# EAGLE design NEECDUINO_V22 (EAGLE 6.1)
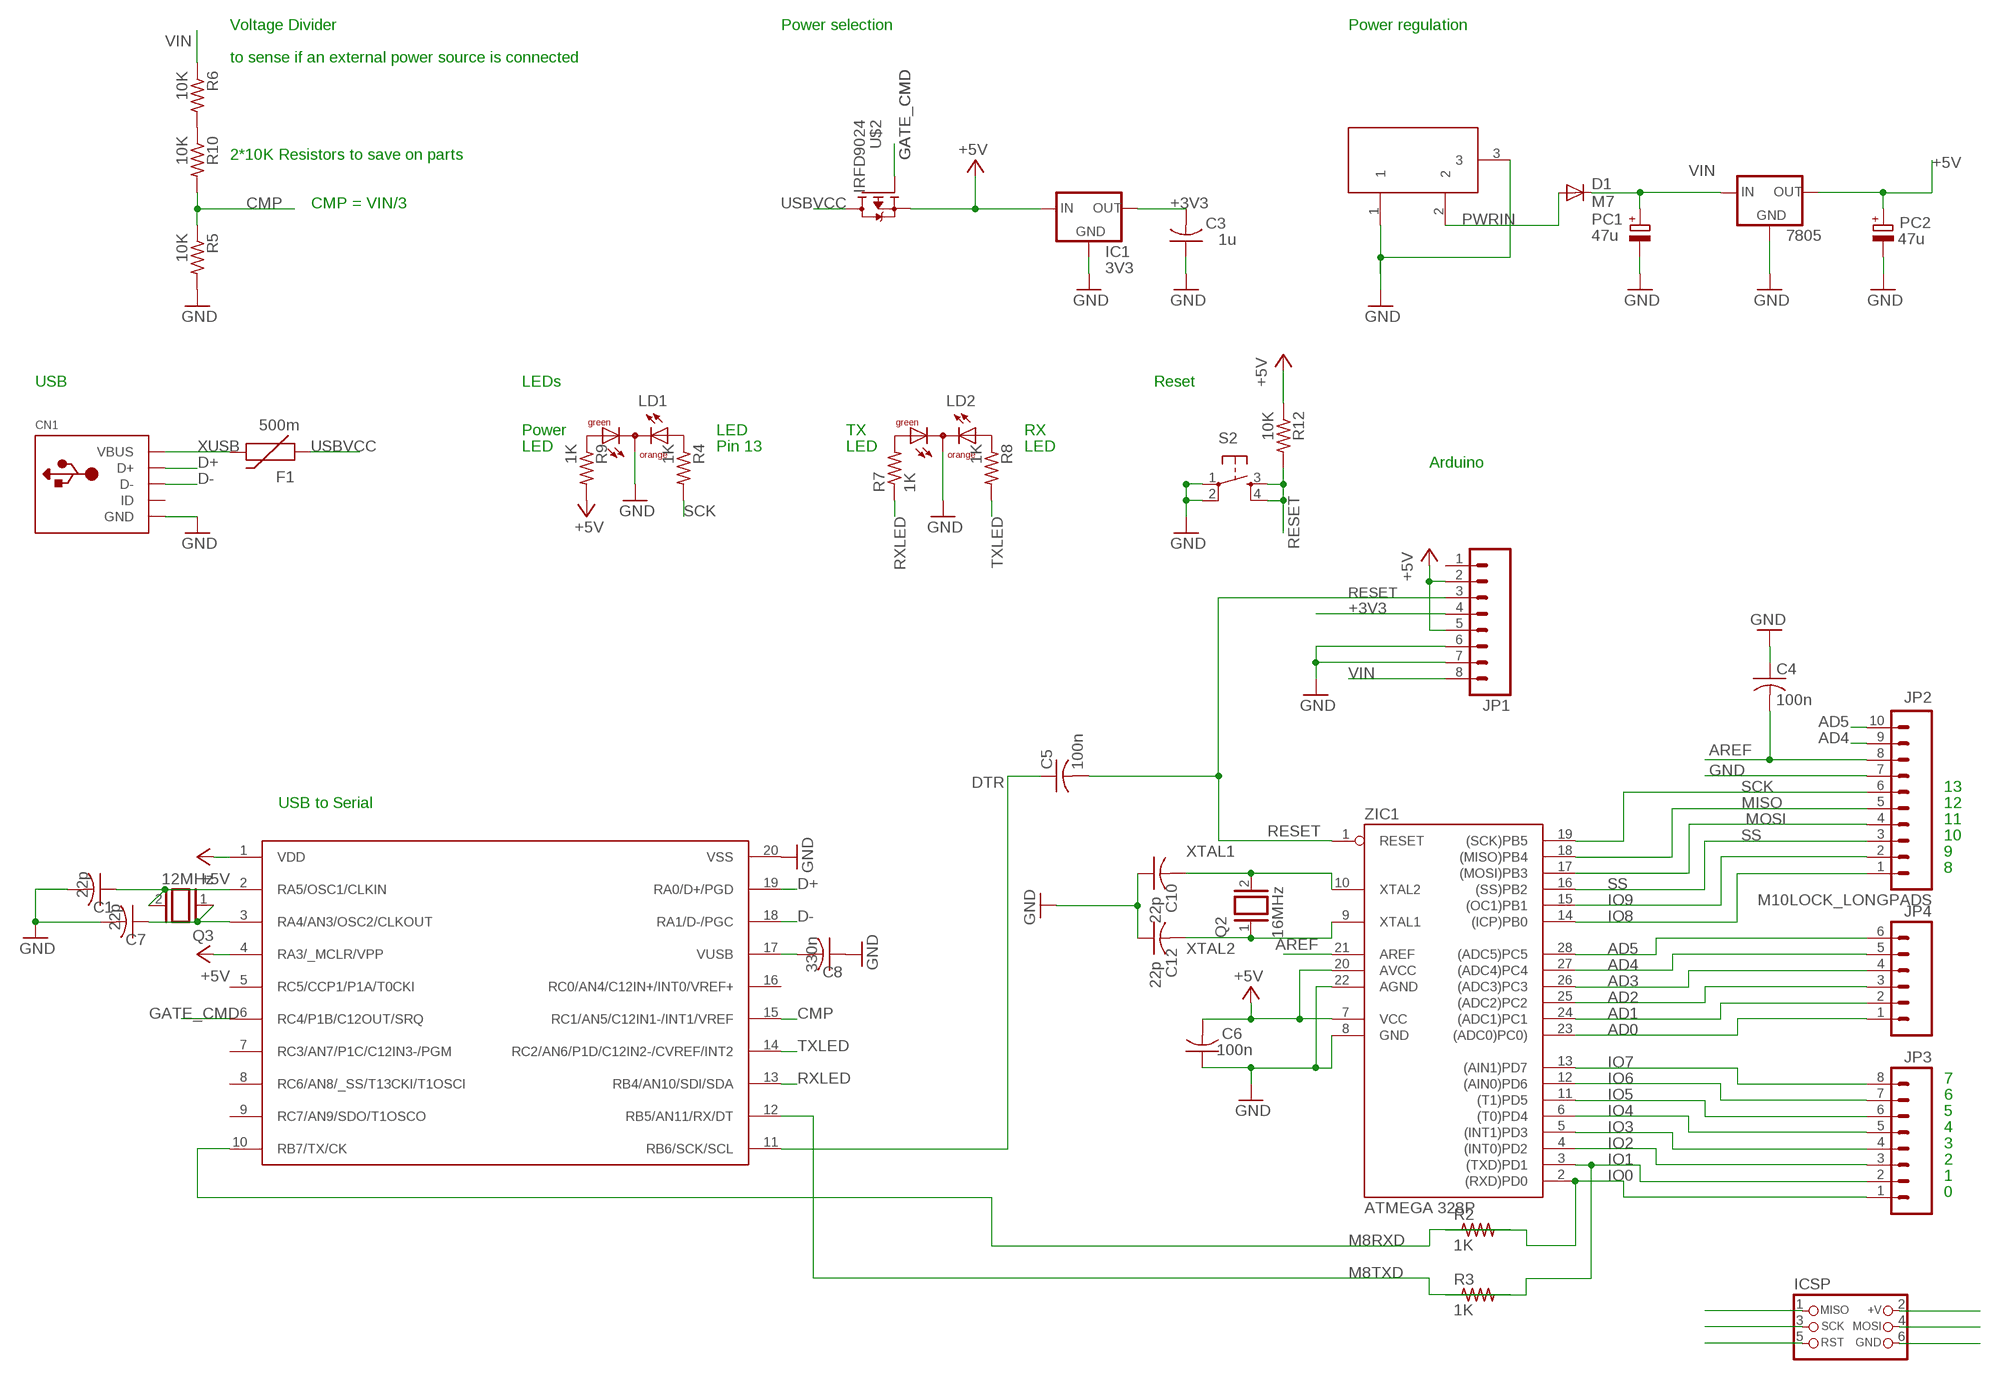
[diagram p0: schematic, sheet 1]

## Parts
7805  78XXL  [78XXL]
C1  22p  C-US025-025X050  [C025-025X050]
C3  1u  C-US050-024X044  [C050-024X044]
C4  100n  C-US025-025X050  [C025-025X050]
C5  100n  C-US025-025X050  [C025-025X050]
C6  100n  C-US025-025X050  [C025-025X050]
C7  22p  C-US025-025X050  [C025-025X050]
C8  330n  C-US025-025X050  [C025-025X050]
C10  22p  C-US025-025X050  [C025-025X050]
C12  22p  C-US025-025X050  [C025-025X050]
CN1  USBMOLEX  [USB-MINIB-THM-MOLEX]
D1  M7  DIODE-D-10  [D-10]
F1  500m  PTCPTH  [PTC]
IC1  3V3  LP2950  [TO92-INLINE]
ICSP  CON_HEADER_PRG_AVR_ICSP  [HEADER_PRG_2X03]
JP1  M08LOCK_LONGPADS  [1X08_LOCK_LONGPADS]
JP2  M10LOCK_LONGPADS  [1X10_LOCK_LONGPADS]
JP3  M08LOCK_LONGPADS  [1X08_LOCK_LONGPADS]
JP4  M06LOCK_LONGPADS  [1X06_LOCK_LONGPADS]
LD1  DUOLED-GO-C  [DUOLED-C-3MM]
LD2  DUOLED-GO-C  [DUOLED-C-3MM]
PC1  47u  CPOL-EUE2.5-5  [E2,5-5]
PC2  47u  CPOL-EUE2.5-5  [E2,5-5]
Q2  16MHz  XTAL/S  [QS]
Q3  12MHz  XTAL/S  [QS]
R2  1K  R-US_0204/5  [0204/5]
R3  1K  R-US_0204/5  [0204/5]
R4  1K  R-US_0204/5  [0204/5]
R5  10K  R-US_0204/5  [0204/5]
R6  10K  R-US_0204/5  [0204/5]
R7  1K  R-US_0204/5  [0204/5]
R8  1K  R-US_0204/5  [0204/5]
R9  1K  R-US_0204/5  [0204/5]
R10  10K  R-US_0204/5  [0204/5]
R12  10K  R-US_0204/5  [0204/5]
S2  TAC_SWITCHPTH  [TACTILE-PTH]
U$1  PIC18F14K50  PIC18XF1XK50  [DIL20]
U$2  IRFD9024  [DIL04]
X1  DC21MMX  [DC-21MM]
ZIC1  ATMEGA 328P  AT90S4433P  [DIL28-3]

## Nets
+3V3 [Power]: C3.2 IC1.1(OUT) JP1.4
+5V [Power]: 7805.OUT C6.2 IC1.3(IN) ICSP.2(+V) JP1.2 JP1.5 PC2.+ R9.2 R12.1 U$1.1(VDD) U$1.4(RA3/_MCLR/VPP) U$2.4(S) ZIC1.7(VCC) ZIC1.20(AVCC)
AD0: JP4.1 ZIC1.23((ADC0)PC0))
AD1: JP4.2 ZIC1.24((ADC1)PC1)
AD2: JP4.3 ZIC1.25((ADC2)PC2)
AD3: JP4.4 ZIC1.26((ADC3)PC3)
AD4: JP2.9 JP4.5 ZIC1.27((ADC4)PC4)
AD5: JP2.10 JP4.6 ZIC1.28((ADC5)PC5)
AREF: C4.2 JP2.8 ZIC1.21(AREF)
CMP: R5.1 R10.2 U$1.15(RC1/AN5/C12IN1-/INT1/VREF)
D+: CN1.D+ U$1.19(RA0/D+/PGD)
D-: CN1.D- U$1.18(RA1/D-/PGC)
DTR: C5.1 U$1.11(RB6/SCK/SCL)
GATE_CMD: U$1.6(RC4/P1B/C12OUT/SRQ) U$2.3(G)
GND: 7805.GND C1.2 C3.1 C4.1 C6.1 C7.2 C8.1 C10.1 C12.1 CN1.GND IC1.2(GND) ICSP.6(GND) JP1.6 JP1.7 JP2.7 LD1.C LD2.C PC1.- PC2.- R5.2 S2.1 S2.2 U$1.20(VSS) X1.1 X1.3 ZIC1.8(GND) ZIC1.22(AGND)
IO0: JP3.1 R2.1 ZIC1.2((RXD)PD0)
IO1: JP3.2 R3.1 ZIC1.3((TXD)PD1)
IO2: JP3.3 ZIC1.4((INT0)PD2)
IO3: JP3.4 ZIC1.5((INT1)PD3)
IO4: JP3.5 ZIC1.6((T0)PD4)
IO5: JP3.6 ZIC1.11((T1)PD5)
IO6: JP3.7 ZIC1.12((AIN0)PD6)
IO7: JP3.8 ZIC1.13((AIN1)PD7)
IO8: JP2.1 ZIC1.14((ICP)PB0)
IO9: JP2.2 ZIC1.15((OC1)PB1)
M8RXD: R2.2 U$1.10(RB7/TX/CK)
M8TXD: R3.2 U$1.12(RB5/AN11/RX/DT)
MISO: ICSP.1(MISO) JP2.5 ZIC1.18((MISO)PB4)
MOSI: ICSP.4(MOSI) JP2.4 ZIC1.17((MOSI)PB3)
N$1: R6.2 R10.1
N$2: LD1.AX(AR) R9.1
N$3: LD1.AR(AY) R4.1
N$4: LD2.AX(AR) R7.2
N$5: LD2.AR(AY) R8.1
N$6: C7.1 Q3.1 U$1.3(RA4/AN3/OSC2/CLKOUT)
N$12: C1.1 Q3.2 U$1.2(RA5/OSC1/CLKIN)
N$15: C8.2 U$1.17(VUSB)
PWRIN [Power]: D1.A X1.2
RESET: C5.2 ICSP.5(RST) JP1.3 R12.2 S2.3 S2.4 ZIC1.1(RESET)
RXLED: R7.1 U$1.13(RB4/AN10/SDI/SDA)
SCK: ICSP.3(SCK) JP2.6 R4.2 ZIC1.19((SCK)PB5)
SS: JP2.3 ZIC1.16((SS)PB2)
TXLED: R8.2 U$1.14(RC2/AN6/P1D/C12IN2-/CVREF/INT2)
USBVCC: F1.P$1 U$2.1(D) U$2.2(D)
VIN [Power]: 7805.IN D1.C JP1.8 PC1.+ R6.1
XTAL1: C10.2 Q2.2 ZIC1.10(XTAL2)
XTAL2: C12.2 Q2.1 ZIC1.9(XTAL1)
XUSB: CN1.VBUS F1.P$2
Unconnected: CN1.ID JP1.1 U$1.5(RC5/CCP1/P1A/T0CKI) U$1.7(RC3/AN7/P1C/C12IN3-/PGM) U$1.8(RC6/AN8/_SS/T13CKI/T1OSCI) U$1.9(RC7/AN9/SDO/T1OSCO) U$1.16(RC0/AN4/C12IN+/INT0/VREF+)

## Notes on the sheet
- Voltage Divider | Power selection | Power regulation
- to sense if an external power source is connected
- 2*10K Resistors to save on parts
- CMP = VIN/3
- USB | LEDs | Reset
- Power | LED | TX | RX
- LED | Pin 13 | LED | LED
- Arduino
- 13
- USB to Serial | 12
- 11
- 10
- 9
- 8
- 7
- 6
- 5
- 4
- 3
- 2
- 1
- 0

## Library data of the parts
7805 = v-reg:78XXL: VOLTAGE REGULATOR
C1 C3-C8 C10 C12 = adafruit:C-US: CAPACITOR, American symbol
CN1 = adafruit:USB: USB Connectors USBMINIB - Surface Mount Female Mini-B USB Connector 4UConnector: 06564 By microbuilder.eu Thru-hole RA Female Mini-B USB Connector 4UConnector: 18732 By ladyada.net
D1 = diode:DIODE-: DIODE
F1 = SparkFun:PTC: Resettable Fuse PTC Resettable Fuse. Spark Fun Electronics SKU : COM-08357
IC1 = pedrodiogo:LP2950?*: Source: http://cache.national.com/ds/LP/LP2950.pdf
ICSP = dp_devices:CON_HEADER_PRG_AVR_ICSP: 2x3 AVR ICSP programming header
JP1 JP3 = SparkFun:M08: Header 8 Standard 8-pin 0.1" header. Use with straight break away headers (SKU : PRT-00116), right angle break away headers (PRT-00553), swiss pins (PRT-00743), machine pins (PRT-00117), and female headers (PRT-00115).
JP2 = SparkFun:M10: Header 10 Standard 10-pin 0.1" header. Use with straight break away headers (SKU : PRT-00116), right angle break away headers (PRT-00553), swiss pins (PRT-00743), machine pins (PRT-00117), and female headers (PRT-00115).
JP4 = SparkFun:M06: Header 6 Standard 6-pin 0.1" header. Use with straight break away headers (SKU : PRT-00116), right angle break away headers (PRT-00553), swiss pins (PRT-00743), machine pins (PRT-00117), and female headers (PRT-00115). Molex polarized connector foot print use with SKU : PRT-08094 with associated crimp pins and housings. NOTES ON THE VARIANTS LOCK and LOCK_LONGPADS... This footprint was designed to help hold the alignment of a through-hole component (i.e. 6-pin header) while soldering it into place. You may notice that each hole has been shifted either up or down by 0.005 of an inch from it's more standard position (which is a perfectly straight line). This slight alteration caused the pins (the squares in the middle) to touch the edges of the holes. Because they are alternating, it causes a "brace" to hold the component in place. 0.005 has proven to be the perfect amount of "off-center" position when using our standard breakaway headers. Although looks a little odd when you look at the bare footprint, once you have a header in there, the alteration is very hard to notice. Also, if you push a header all the way into place, it is covered up entirely on the bottom side. This idea of altering the position of holes to aid alignment will be further integrated into the Sparkfun Library for other footprints. It can help hold any component with 3 or more connection pins.
LD1 LD2 = pedrodiogo:DUOLED-GO-C: DUO LED 2 colors (green/orange), 3 mm, round, common Cathode
PC1 PC2 = rcl:CPOL-EU: POLARIZED CAPACITOR, European symbol
Q2 Q3 = special:XTAL/S: CRYSTAL
R2-R10 R12 = adafruit:R-US_: RESISTOR, American symbol
S2 = SparkFun:TAC_SWITCH: Momentary Switch Button commonly used for reset or general input. Spark Fun Electronics SKU : COM-00097
U$1 = PIC18F1xK50:PIC18XF1XK50: PIC18F13K50/14K50 PIC18LF13K50/14K50
U$2 = pedrodiogo:IRFD9024
X1 = powersupply:DC21MM
ZIC1 = atmel:AT90S4433: MICROCONTROLLER 4 Kbytes FLASH 128 bytes SRAM 256 bytes EEPROM UART 6-channel 10 bit ADC

## Net classes
0 default: width 0.305 mm, drill 0.305 mm, clearance 0.203 mm
1 Power: width 1.016 mm, drill 0.61 mm, clearance 0.305 mm

## Board
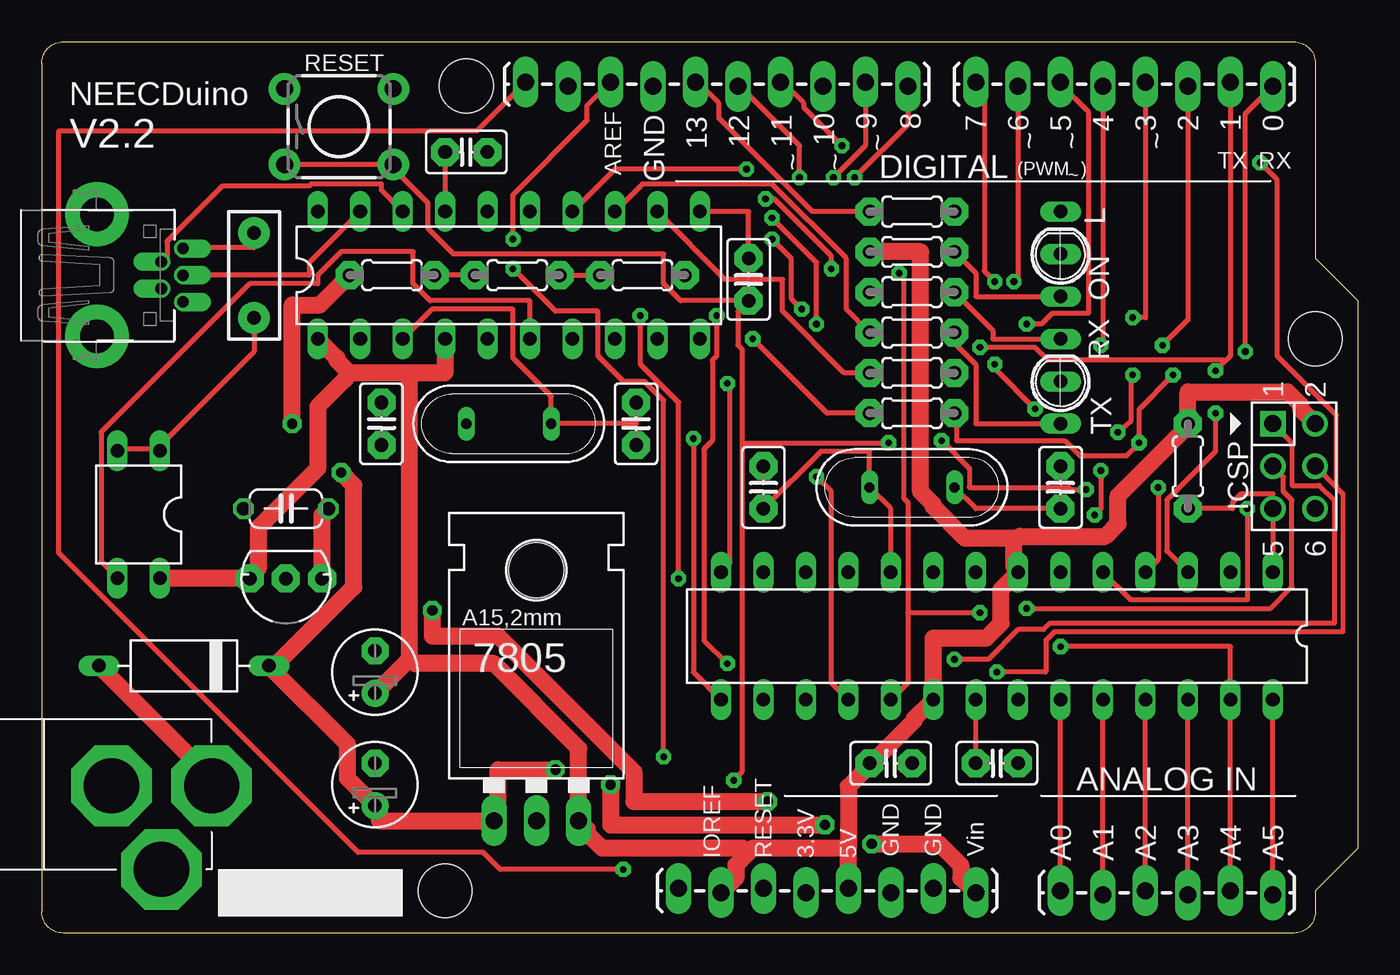
[diagram p1: board, top side]
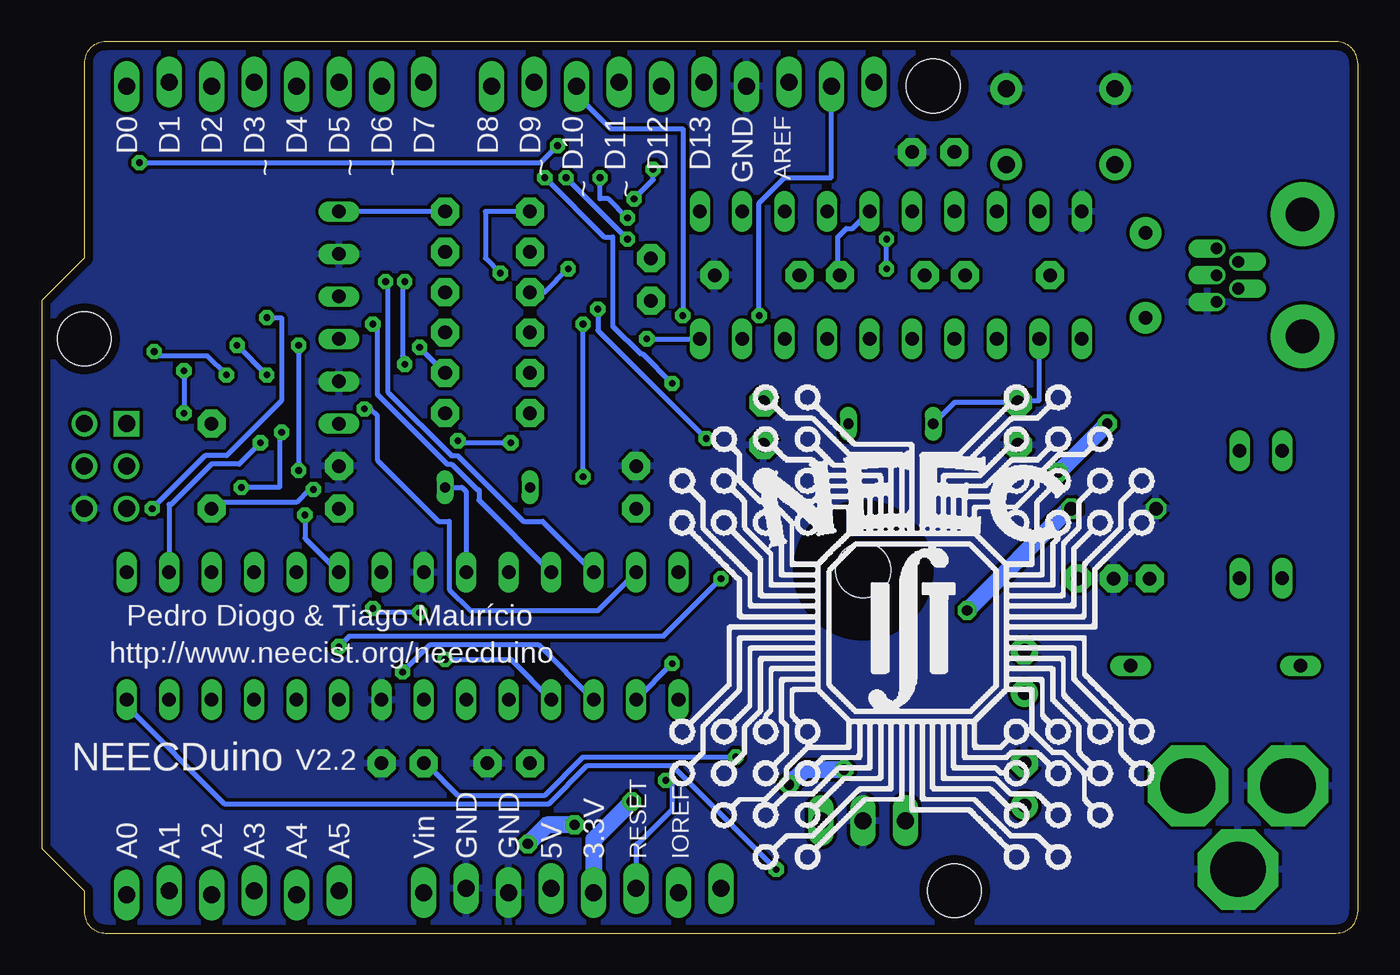
[diagram p2: board, bottom side, seen from below]

Size 78.74 x 53.34 mm. Coordinates in mm from the lower left corner, seen from the top.
Outline: 0,52.07 0,1.27 arc90 1.27,0 74.93,0 arc90 76.2,1.27 76.2,2.54 78.74,5.08 78.74,37.85 76.2,40.39 76.2,52.07 arc90 74.93,53.34 1.27,53.34 arc90 0,52.07
Copper layers (1*16): Top 0.035mm / dielectric 1.5mm / Bottom 0.035mm
Design rules: minimum track width 8mil, minimum drill 0.4mm, track to track 8mil, track to pad 8mil, pad to pad 8mil, via to via 8mil, smd to smd 8mil, copper to edge 20mil, drill to drill 8mil, minimum pad ring 8mil, minimum via ring 10mil, stop-mask expansion 3mil, vias tented up to drill 0mil, thermal gap 8mil
Holes 3.2 mm at 24.13,2.54 76.2,35.56 25.4,50.7
tKeepout: area 21.1,30.5 to 29.7,30.5
bKeepout: area 20.8,30.5 to 29.8,30.6; area 18.8,7.3 to 24.4,13
tRestrict: area 25.8,17.9 to 33.4,25.6

### Footprints (pad centres in the part's own frame; a part is rotated, then mirrored left to right if it is on the bottom)
78XXL = drill 1.016 long: GND 0,-3.81; IN -2.54,-3.81; OUT 2.54,-3.81 | hole 3.302: 0,11.176
C025-025X050 = drill 0.813 pad 1.676 octagon: 1 -1.27,0; 2 1.27,0
C050-024X044 = drill 0.813 octagon: 1 -2.54,0; 2 2.54,0
USB-MINIB-THM-MOLEX = drill 0.7 offset: D+ 0,9.72; D- -0.8,8.42; GND 1.6,9.72; ID 0.8,8.42; VBUS -1.6,9.72 | drill 2 pad 3.81: GND1 -3.65,4.57; GND4 3.65,4.57
D-10 = drill 0.813 long: A 5.08,0; C -5.08,0
PTC = drill 0.8 pad 1.88: P$1 -2.54,0; P$2 2.54,0
TO92-INLINE = drill 0.813 pad 1.676 octagon: 1 -2.159,0; 2 0,0; 3 2.159,0
HEADER_PRG_2X03 = drill 1.016 square: 1 -2.54,-1.27 | drill 1.016: 2 -2.54,1.27; 3 0,-1.27; 4 0,1.27; 5 2.54,-1.27; 6 2.54,1.27
1X08_LOCK_LONGPADS = drill 1.016 long: 1 0,0.127; 2 2.54,-0.127; 3 5.08,0.127; 4 7.62,-0.127; 5 10.16,0.127; 6 12.7,-0.127; 7 15.24,0.127; 8 17.78,-0.127
1X10_LOCK_LONGPADS = drill 1.016 long: 1 0,0.127; 2 2.54,-0.127; 3 5.08,0.127; 4 7.62,-0.127; 5 10.16,0.127; 6 12.7,-0.127; 7 15.24,0.127; 8 17.78,-0.127; 9 20.32,0.127; 10 22.86,-0.127
1X06_LOCK_LONGPADS = drill 1.016 long: 1 0,0; 2 2.54,-0.254; 3 5.08,0; 4 7.62,-0.254; 5 10.16,0; 6 12.7,-0.254
DUOLED-C-3MM = drill 0.813 long: AR 2.54,0; AX -2.54,0; C 0,0
E2,5-5 = drill 0.813 pad 1.6: + -1.27,0 | drill 0.813 pad 1.6 octagon: - 1.27,0
QS = drill 0.61 long: 1 -2.54,0; 2 2.54,0
0204/5 = drill 0.813 pad 1.676 octagon: 1 -2.54,0; 2 2.54,0
TACTILE-PTH = drill 1.016 pad 1.88: 1 -3.251,2.261; 2 3.251,2.261; 3 -3.251,-2.261; 4 3.251,-2.261
DIL20 = drill 0.813 long: 1 -11.43,-3.81; 2 -8.89,-3.81; 3 -6.35,-3.81; 4 -3.81,-3.81; 5 -1.27,-3.81; 6 1.27,-3.81; 7 3.81,-3.81; 8 6.35,-3.81; 9 8.89,-3.81; 10 11.43,-3.81; 11 11.43,3.81; 12 8.89,3.81; 13 6.35,3.81; 14 3.81,3.81; 15 1.27,3.81; 16 -1.27,3.81; 17 -3.81,3.81; 18 -6.35,3.81; 19 -8.89,3.81; 20 -11.43,3.81
DIL04 = drill 0.813 long: 1 -1.27,-3.81; 2 1.27,-3.81; 3 1.27,3.81; 4 -1.27,3.81
DC-21MM = drill 3.302 pad 4.826 octagon: 1 -5.08,-3.353; 2 -0.076,-6.35; 3 -0.076,-0.356
DIL28-3 = drill 0.813 long: 1 -16.51,-3.81; 2 -13.97,-3.81; 3 -11.43,-3.81; 4 -8.89,-3.81; 5 -6.35,-3.81; 6 -3.81,-3.81; 7 -1.27,-3.81; 8 1.27,-3.81; 9 3.81,-3.81; 10 6.35,-3.81; 11 8.89,-3.81; 12 11.43,-3.81; 13 13.97,-3.81; 14 16.51,-3.81; 15 16.51,3.81; 16 13.97,3.81; 17 11.43,3.81; 18 8.89,3.81; 19 6.35,3.81; 20 3.81,3.81; 21 1.27,3.81; 22 -1.27,3.81; 23 -3.81,3.81; 24 -6.35,3.81; 25 -8.89,3.81; 26 -11.43,3.81; 27 -13.97,3.81; 28 -16.51,3.81

### Placement (x,y rotation side)
7805  29.59,10.54 0 top
C1  20.32,30.48 270 top
C3  14.61,25.4 0 top
C4  57.15,10.16 180 top
C5  42.29,39.12 270 top
C6  50.8,10.16 180 top
C7  35.56,30.48 270 top
C8  25.4,46.74 180 top
C10  43.18,26.67 270 top
C12  60.96,26.67 270 top
CN1  -1.27,39.37 270 top
D1  8.51,16 180 top
F1  12.7,39.37 90 top
IC1  14.61,21.21 180 top
ICSP  74.93,27.94 270 top
JP1  38.1,2.54 0 top
JP2  51.82,50.8 180 top
JP3  73.66,50.8 180 top
JP4  60.96,2.54 0 top
LD1  60.96,40.64 90 top
LD2  60.96,33.02 90 top
PC1  19.94,8.89 90 top
PC2  19.94,15.62 90 top
Q2  52.07,26.67 180 top
Q3  27.94,30.48 180 top
R2  52.07,31.11 180 top
R3  52.07,33.53 180 top
R4  52.07,43.18 180 top
R5  35.94,39.37 0 top
R6  20.96,39.37 0 top
R7  52.07,35.94 0 top
R8  52.07,38.35 180 top
R9  52.07,40.77 180 top
R10  28.45,39.37 0 top
R12  68.58,27.94 270 top
S2  17.78,48.26 0 top
U$1  27.94,39.37 0 top
U$2  5.79,25.05 180 top
X1  3.81,8.89 90 top
ZIC1  57.15,17.78 180 top

### Tracks (layer width: path | path; a pad name or v marks a point on that pad's centre or on a via)
+3V3  (via drill 0.61)
  Top 1.016: C3.2 16.76,25.02 IC1.1 | v43.43,7.87 35.43,7.87 35.43,9.65 27.31,17.78 23.37,17.78 v23.37,19.3
  Bottom 1.016: JP1.4 45.72,5.59 v43.43,7.87 | v23.37,19.3 17.27,25.4 C3.2
+5V
  Top 1.016: U$2.4 7.11,21.21 IC1.3 12.7,21.59 12.95,21.84 12.95,24.26 16.51,27.81 16.51,31.5 18.16,33.15 18.42,33.53 | U$1.1 17.65,34.42 17.65,34.29 18.42,33.53 | 21.97,33.53 24.13,33.53 U$1.4 | 21.97,33.53 18.42,33.53 | 21.97,16.38 PC2.+ | 21.97,33.53 21.97,16.38 | JP1.2 41.53,3.3 41.53,4.06 42.23,4.76 | 42.23,4.76 42.55,5.08 48.26,5.08 | JP1.5 48.26,5.08 | 42.23,4.76 41.91,5.08 33.53,5.08 32.64,5.97 32.64,6.22 7805.OUT 32.13,11.05 27.05,16.13 22.35,16.13 21.97,16.38 | ICSP.2 75.31,31.37 75.31,31.62 74.55,32.38 68.58,32.38 R12.1 68.33,30.1 64.39,26.16 64.39,24.51 63.63,23.75 58.55,23.75 58.17,23.62 | R9.2 52.58,40.77 52.58,26.42 53.34,25.65 53.34,25.53 55.24,23.62 58.17,23.62 | 58.17,23.62 58.17,21.97 ZIC1.7 57.4,20.57 57.4,18.54 56.52,17.65 53.34,17.65 ZIC1.20 52.2,12.83 52.2,12.7 49.66,10.16 C6.2 49.28,9.78 48.26,8.76 48.26,5.08
AD0
  Top 0.305: JP4.1 ZIC1.23
AD1
  Top 0.305: JP4.2 ZIC1.24
AD2
  Top 0.305: JP4.3 ZIC1.25
AD3
  Top 0.305: JP4.4 ZIC1.26
AD4  (via drill 0.4)
  Top 0.305: JP4.5 ZIC1.27 71.12,17.14 v60.96,17.14 | v35.81,36.96 35.81,34.04 38.1,31.75 v38.1,21.21
  Bottom 0.305: v35.81,36.96 35.81,43.69 34.29,45.21 31.5,45.21 JP2.9 | v38.1,21.21 41.53,17.78 60.33,17.78 v60.96,17.14
AD5  (via drill 0.4)
  Top 0.305: JP4.6 ZIC1.28 | v34.8,3.81 27.43,3.81 26.42,4.83 18.92,4.83 1.02,22.73 1.02,48.01 26.04,48.01 JP2.10
  Bottom 0.305: v34.8,3.81 41.02,10.03 46.1,10.03 48.39,7.75 67.82,7.75 73.66,13.59 ZIC1.28
AREF  (via drill 0.4)
  Top 0.305: C4.2 ZIC1.21 | v28.19,41.53 28.19,44.2 32.64,48.64 32.64,49.53 JP2.8 | v28.19,39.75 30.73,37.21 33.27,37.21 33.27,34.54 34.8,33.02 36.07,33.02 37.21,31.88 v37.21,10.54
  Bottom 0.305: v28.19,39.75 v28.19,41.53 | v37.21,10.54 46.35,10.54 48.64,8.26 53.85,8.26 55.75,10.16 C4.2
CMP
  Top 0.305: R10.2 R5.1
  Bottom 0.305: U$1.15 30.23,42.16 30.61,42.16 31.11,41.66 31.11,39.37 R10.2
D+
  Top 0.305: CN1.D+ 16,39.37 16,40.13 U$1.19
D-
  Top 0.305: CN1.D- 7.49,40.51 7.49,41.4 10.79,44.7 16,44.7 16.13,44.83 20.32,44.83 20.32,44.45 U$1.18
DTR
  Top 0.305: U$1.11 42.29,43.18 C5.1
GATE_CMD
  Top 0.305: U$1.6 29.21,37.85 23.24,37.85 22.22,38.86 22.22,40.77 17.91,40.77 16.51,39.37 16.51,38.86 12.45,38.86 3.56,29.97 3.56,22.23 4.45,21.34 U$2.3
GND
  pour Bottom: 0,45.72 0,52.07 arc-90 1.27,53.34 74.93,53.34 arc-90 76.2,52.07 76.2,40.64 78.74,38.1 78.74,5.08 76.2,2.54 76.2,1.27 arc-90 74.93,0 1.27,0 arc-90 0,1.27
  pour Bottom: 0,45.72 0,52.07 arc-90 1.27,53.34 74.93,53.34 arc-90 76.2,52.07 76.2,40.64 78.74,38.1 78.74,5.08 76.2,2.54 76.2,1.27 arc-90 74.93,0 1.27,0 arc-90 0,1.27
IO0  (via drill 0.4)
  Top 0.305: R2.1 54.74,30.99 54.74,29.46 61.21,29.46 62.1,28.57 64.9,28.57 v65.66,29.34 65.66,31.37 v67.69,33.4 | JP3.1 72.01,49.02 v72.01,34.8
  Bottom 0.305: ZIC1.2 71.12,25.65 70.99,25.65 68.58,28.07 66.93,28.07 v65.66,29.34 | v72.01,34.8 71.75,34.54 68.83,34.54 v67.69,33.4
IO1  (via drill 0.4)
  Top 0.305: ZIC1.3 67.31,22.86 67.31,25.91 70.23,28.83 v70.23,31.11 | 70.8,34.23 71.12,34.54 JP3.2 | 70.8,34.23 v70.23,33.66 | v56.13,35.05 59.44,35.05 60.2,34.29 70.74,34.29 70.8,34.23
  Bottom 0.305: v70.23,33.66 v70.23,31.11 | v56.13,35.05 R3.1
IO2  (via drill 0.4)
  Top 0.305: ZIC1.4 66.8,22.35 v66.8,26.67 | v64.39,29.97 65.15,30.61 65.15,33.27 v65.28,33.4 | v67.06,35.18 68.58,36.7 JP3.3
  Bottom 0.305: v64.39,29.97 64.52,29.97 64.52,26.67 v66.8,26.67 | v67.06,35.18 v65.28,33.4
IO3  (via drill 0.4)
  Top 0.305: ZIC1.5 65.15,19.94 72.14,19.94 v72.14,25.4 | v65.28,36.83 66.04,36.83 JP3.4
  Bottom 0.305: v72.14,25.4 68.96,28.57 67.69,28.57 64.39,31.88 64.39,36.83 v65.28,36.83
IO4  (via drill 0.4)
  Top 0.305: v62.99,25.02 63.37,25.4 v63.37,27.69 | v63.37,35.18 63.5,35.56 JP3.5
  Bottom 0.305: ZIC1.6 62.99,23.62 v62.99,25.02 | v63.37,35.18 v63.37,27.69
IO5  (via drill 0.4)
  Top 0.305: v58.93,36.45 59.82,36.45 60.45,37.08 62.61,37.08 62.61,49.15 60.96,50.8 JP3.6
  Bottom 0.305: ZIC1.11 52.58,25.91 52.58,26.54 52.7,26.54 54.23,28.07 54.48,28.07 58.67,32.26 58.67,36.45 v58.93,36.45
IO6  (via drill 0.4)
  Top 0.305: v58.17,38.99 58.42,39.24 JP3.7
  Bottom 0.305: ZIC1.12 48.77,24.64 49.91,24.64 53.85,28.57 54.23,28.57 58.04,32.38 58.04,38.99 v58.17,38.99
IO7  (via drill 0.4)
  Top 0.305: v59.44,31.37 57.02,33.78 v57.02,34.04 | v57.02,38.99 56.39,39.62 56.39,50.42 JP3.8
  Bottom 0.305: ZIC1.13 45.47,19.3 53.09,19.3 54.36,20.57 54.36,24.64 54.99,24.64 58.67,28.32 58.67,30.99 59.05,31.37 v59.44,31.37 | v57.02,34.04 57.02,34.42 57.15,34.54 57.15,38.99 v57.02,38.99
IO8  (via drill 0.4)
  Top 0.305: ZIC1.14 41.15,22.1 41.15,32.77 v41.02,32.89 | v48.64,45.21 51.82,48.39 JP2.1
  Bottom 0.305: v41.02,32.89 42.8,34.67 42.93,34.67 44.58,36.32 44.58,41.66 45.08,41.66 v48.64,45.21
IO9  (via drill 0.4)
  Top 0.305: ZIC1.15 38.99,15.62 v38.99,29.59 | v45.47,37.34 44.83,37.97 44.83,40.39 v43.69,41.53 | v47.37,45.21 49.28,47.12 JP2.2
  Bottom 0.305: v38.99,29.59 45.47,36.07 v45.47,37.34 | v47.37,45.21 v43.69,41.53
M8RXD  (via drill 0.4)
  Top 0.305: v42.55,35.56 46.99,31.11 R2.2
  Bottom 0.305: v42.55,35.56 U$1.10
M8TXD
  Top 0.305: U$1.12 40.89,39.12 44.32,39.12 44.32,37.21 48.01,33.53 R3.2
MISO  (via drill 0.4)
  Top 0.305: v54.61,16.38 56.64,16.38 58.42,18.16 59.94,18.16 60.33,18.54 77.34,18.54 77.34,25.91 76.45,26.8 74.8,26.8 74.8,29.34 ICSP.1 | v45.34,45.21 45.34,47.12 41.78,50.67 JP2.5 | v43.69,42.8 46.35,40.13 v46.35,36.45 | v46.35,27.3 47.24,26.42 47.24,14.99 ZIC1.18
  Bottom 0.305: ZIC1.18 50.67,16.38 v54.61,16.38 | v45.34,45.21 45.34,43.94 44.83,43.94 v43.69,42.8 | v46.35,27.3 v46.35,36.45
MOSI  (via drill 0.4)
  Top 0.305: v57.15,15.62 60.07,15.62 60.07,17.53 60.58,18.03 77.85,18.03 77.85,26.29 77.41,26.73 | ICSP.4 77.41,26.73 | v47.88,47.12 45.59,49.4 45.59,49.66 44.32,50.93 JP2.4 | v72.9,46.1 73.91,45.09 73.91,34.54 77.47,30.99 77.47,26.8 77.41,26.73
  Bottom 0.305: ZIC1.17 49.02,17.27 55.5,17.27 v57.15,15.62 | v47.88,47.12 48.89,46.1 v72.9,46.1
N$1
  Top 0.305: R10.1 R6.2
N$2
  Top 0.305: LD1.AX 55.88,38.1 55.88,39.5 R9.1
N$3
  Bottom 0.305: R4.1 LD1.AR
N$4
  Top 0.305: LD2.AX 55.88,30.48 55.88,34.04 54.61,35.31 R7.2
N$5
  Top 0.305: LD2.AR 56.9,35.56 56.9,36.07 R8.1
N$6
  Top 0.305: C7.1 35.56,30.48 Q3.1 30.48,32.13 28.19,34.42 28.19,37.34 23.37,37.34 U$1.3
N$12
  Bottom 0.305: Q3.2 24.13,31.75 C1.1 20.32,31.88 19.05,31.88 U$1.2
N$15
  Top 0.305: C8.2 U$1.17
PWRIN
  Top 1.016: D1.A 10.16,9.27 X1.2
RESET  (via drill 0.4)
  Top 0.305: ZIC1.1 ICSP.5 73.66,26.29 71.75,26.29 71.25,25.78 71.25,25.4 R12.2 | S2.3 14.61,45.97 20.96,45.97 S2.4 20.96,45.85 23.11,43.69 23.11,42.16 24.64,40.64 37.21,40.64 37.21,38.86 38.23,37.85 C5.2 41.66,37.21 41.66,35.18 41.91,34.92 41.91,29.34 | v41.4,9.14 41.91,9.65 41.91,29.34 | v62.48,26.54 61.59,26.54 61.47,26.67 55.5,26.67 55.5,27.81 v53.85,29.46 | 41.91,29.34 v50.67,29.34
  Bottom 0.305: JP1.3 43.18,5.33 43.05,5.33 41.02,7.37 41.02,9.14 v41.4,9.14 | R12.2 68.2,25.78 63.5,25.78 62.74,26.54 v62.48,26.54 | v53.85,29.46 53.72,29.34 v50.67,29.34
RXLED
  Top 0.305: U$1.13 35.94,44.83 43.69,44.83 48.13,40.39 48.13,37.34 R7.1
SCK  (via drill 0.4)
  Top 0.305: ZIC1.19 51.82,14.99 51.82,19.18 | 51.82,19.18 51.82,25.78 51.56,26.04 51.56,39.24 v51.31,39.5 | R4.2 46.1,43.18 40.51,48.77 40.51,49.66 39.24,50.93 JP2.6 | ICSP.3 74.3,27.3 74.3,26.42 74.8,25.91 74.8,20.7 73.53,19.43 v58.93,19.43 | 51.82,19.18 v56.13,19.18
  Bottom 0.305: v51.31,39.5 52.2,40.39 52.2,43.18 R4.2 | v58.93,19.43 58.67,19.18 v56.13,19.18
SS  (via drill 0.4)
  Top 0.305: v41.02,16.13 39.62,17.53 39.62,28.96 40.13,29.46 40.13,34.29 40.39,34.54 v40.39,36.96
  Bottom 0.305: v41.02,16.13 ZIC1.16 | v40.39,36.96 40.39,48.13 44.7,48.13 46.74,50.16 JP2.3
TXLED  (via drill 0.4)
  Top 0.305: U$1.14 34.29,45.72 v42.16,45.72 | v43.31,43.94 43.81,43.94 47.24,40.51 v47.24,39.75
  Bottom 0.305: v42.16,45.72 42.16,45.09 v43.31,43.94 | v47.24,39.75 48.64,38.35 R8.2
USBVCC
  Top 0.305: U$2.2 4.57,28.96 6.98,28.96 U$2.1 6.98,29.08 12.7,34.8 F1.P$1
VIN  (via drill 0.61)
  Top 1.016: JP1.8 54.99,3.3 54.99,4.06 53.72,5.33 v49.66,5.33 | v46.86,6.48 34.04,6.48 v34.04,8.89 | v30.73,9.78 27.31,9.78 27.31,7.11 7805.IN 20.19,6.73 20.19,7.24 PC1.+ 18.29,9.27 18.29,11.3 D1.C 14.1,16.13 18.67,20.7 18.67,26.8 v17.91,27.56 | R6.1 16.64,37.59 14.99,37.59 v14.99,30.48
  Bottom 1.016: v49.66,5.33 48.51,6.48 v46.86,6.48 | v34.04,8.89 33.15,9.78 v30.73,9.78 | v17.91,27.56 v14.99,30.48
XTAL1
  Top 0.305: ZIC1.10 50.8,25.4 Q2.2 49.53,28.83 46.61,28.83 C10.2
XTAL2
  Top 0.305: Q2.1 55.88,25.4 C12.2
  Bottom 0.305: ZIC1.9 53.34,26.42 53.59,26.67 Q2.1
XUSB
  Top 0.305: F1.P$2 12.7,41.02 8.51,41.02 CN1.VBUS

### Text on the board
tPlace: RESET | NEECDuino | AREF | GND | 13 | 12 | 11 | 10 | 9 | 8 | 7 | 6 | 5 | 4 | 3 | 2 | 1 | 0 | ~ | ~ | ~ | ~ | V2.2 | ~ | ~ | DIGITAL | (PWM ) | TX | RX | ~ | L | ON | RX | TX | ANALOG IN | GND | GND | Vin | IOREF | RESET | 3.3V | 5V | A0 | A1 | A2 | A3 | A4 | A5
bPlace: AREF | GND | D13 | D12 | D11 | D10 | D9 | D8 | D7 | D6 | D5 | D4 | D3 | D2 | D1 | D0 | ~ | ~ | ~ | ~ | ~ | ~ | Pedro Diogo & Tiago Maurício | http://www.neecist.org/neecduino | V2.2 | NEECDuino | IOREF | RESET | 3.3V | 5V | GND | GND | Vin | A5 | A4 | A3 | A2 | A1 | A0